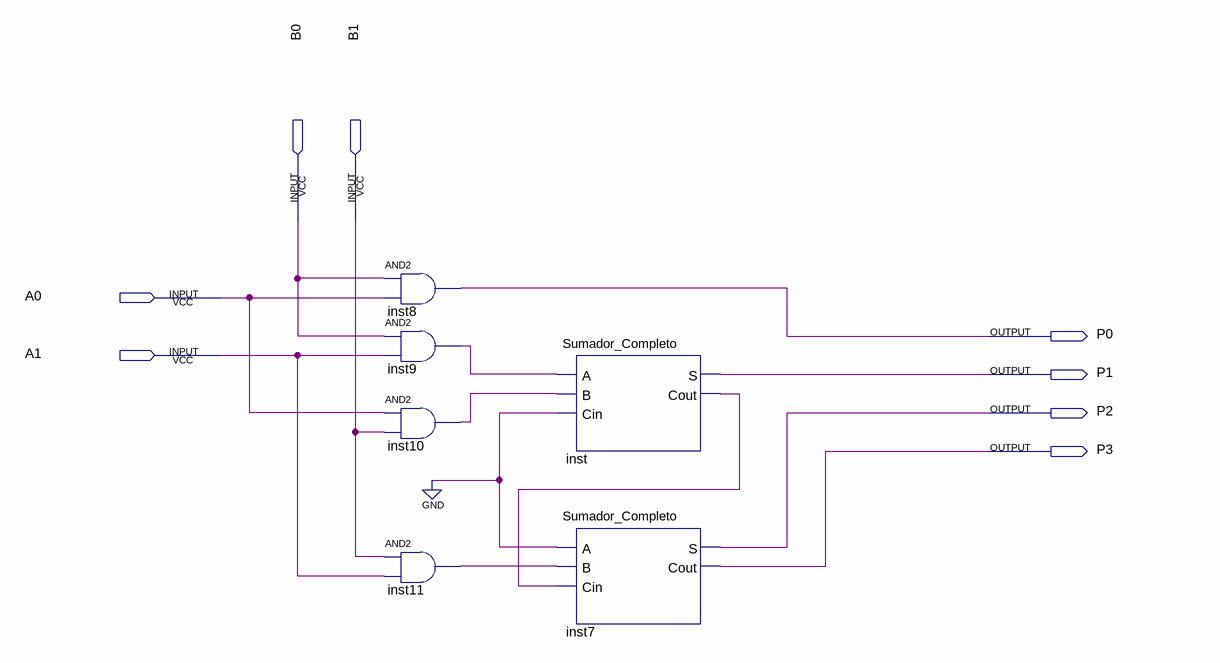
[diagram p0: schematic sheet]
// Quartus schematic Multiplicador2x2.bdf as structural Verilog: 6 symbols, 8 pins
module Multiplicador2x2 (
  input  B0,
  input  B1,
  input  A0,
  input  A1,
  output P0,
  output P1,
  output P2,
  output P3
);

  wire inst9_out, inst10_out, inst11_out, inst_cout;

  and inst8 (P0, B0, A0);
  and inst9 (inst9_out, B0, A1);
  and inst10 (inst10_out, A0, B1);
  and inst11 (inst11_out, B1, A1);
  Sumador_Completo inst (.A(inst9_out), .B(inst10_out), .Cin(1'b0), .S(P1), .Cout(inst_cout));
  Sumador_Completo inst7 (.A(1'b0), .B(inst11_out), .Cin(inst_cout), .S(P2), .Cout(P3));
endmodule
